# Altium schematic sheet BMAv1.0.SchDoc
size A3
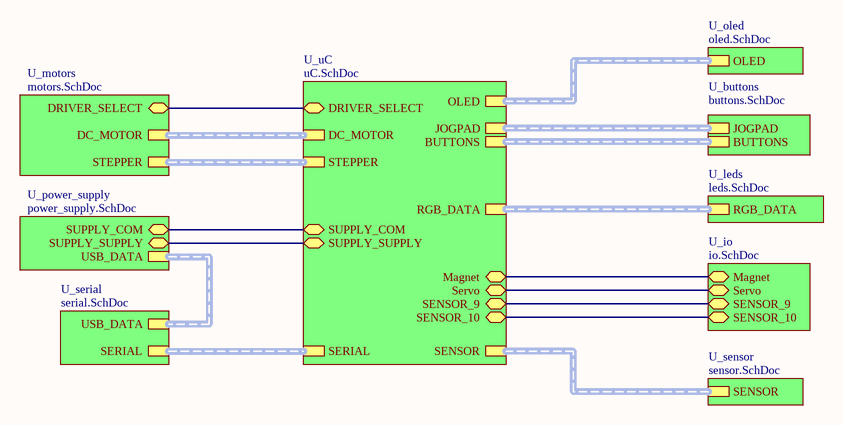
[diagram p0: BMAv1.0.SchDoc]

## Sub-sheets
U_buttons = buttons.SchDoc: BUTTONS (harness BUTTONS), JOGPAD (harness JOGPAD)
U_io = io.SchDoc: Magnet (bidir), Servo (bidir), SENSOR_9 (bidir), SENSOR_10 (bidir)
U_leds = leds.SchDoc: RGB_DATA (harness RGB_DATA)
U_motors = motors.SchDoc: DC_MOTOR (harness DC_MOTOR), STEPPER (harness STEPPER), DRIVER_SELECT (bidir)
U_oled = oled.SchDoc: OLED (harness OLED)
U_power_supply = power_supply.SchDoc: USB_DATA (harness USB_DATA), SUPPLY_SUPPLY (bidir), SUPPLY_COM (bidir)
U_sensor = sensor.SchDoc: SENSOR (harness SENSOR)
U_serial = serial.SchDoc: SERIAL (harness SERIAL), USB_DATA (harness USB_DATA)
U_uC = uC.SchDoc: STEPPER (harness STEPPER), DRIVER_SELECT (bidir), OLED (harness OLED), DC_MOTOR (harness DC_MOTOR), SUPPLY_COM (bidir), SUPPLY_SUPPLY (bidir), JOGPAD (harness JOGPAD), BUTTONS (harness BUTTONS), SERIAL (harness SERIAL), RGB_DATA (harness RGB_DATA), Magnet (bidir), Servo (bidir), SENSOR (harness SENSOR), SENSOR_9 (bidir), SENSOR_10 (bidir)

## Nets
(unnamed): sheet U_uC/DRIVER_SELECT, sheet U_motors/DRIVER_SELECT
(unnamed): sheet U_uC/SUPPLY_COM, sheet U_power_supply/SUPPLY_COM
(unnamed): sheet U_uC/SUPPLY_SUPPLY, sheet U_power_supply/SUPPLY_SUPPLY
(unnamed): sheet U_uC/Magnet, sheet U_io/Magnet
(unnamed): sheet U_uC/Servo, sheet U_io/Servo
(unnamed): sheet U_uC/SENSOR_9, sheet U_io/SENSOR_9
(unnamed): sheet U_uC/SENSOR_10, sheet U_io/SENSOR_10

## Buses and harness runs
harness sheet U_buttons/BUTTONS = sheet U_uC/BUTTONS
harness sheet U_buttons/JOGPAD = sheet U_uC/JOGPAD
harness sheet U_leds/RGB_DATA = sheet U_uC/RGB_DATA
harness sheet U_motors/DC_MOTOR = sheet U_uC/DC_MOTOR
harness sheet U_motors/STEPPER = sheet U_uC/STEPPER
harness sheet U_oled/OLED = sheet U_uC/OLED
harness sheet U_power_supply/USB_DATA = sheet U_serial/USB_DATA
harness sheet U_sensor/SENSOR = sheet U_uC/SENSOR
harness sheet U_serial/SERIAL = sheet U_uC/SERIAL

## Notes on the sheet
- 1
- 2
- 3
- 4
- 5
- 6
- 7
- 8
- A
- B
- C
- D
- Project:
- Date:
- Drawing number:
- Rev:
- Format:
- A3
- Drawn by:
- Laboratory:
- Page
- Sheet:
- of
- File: